# Altium schematic sheet GPS_L70.SchDoc
size A; SheetNumber: 7; SheetTotal: 7
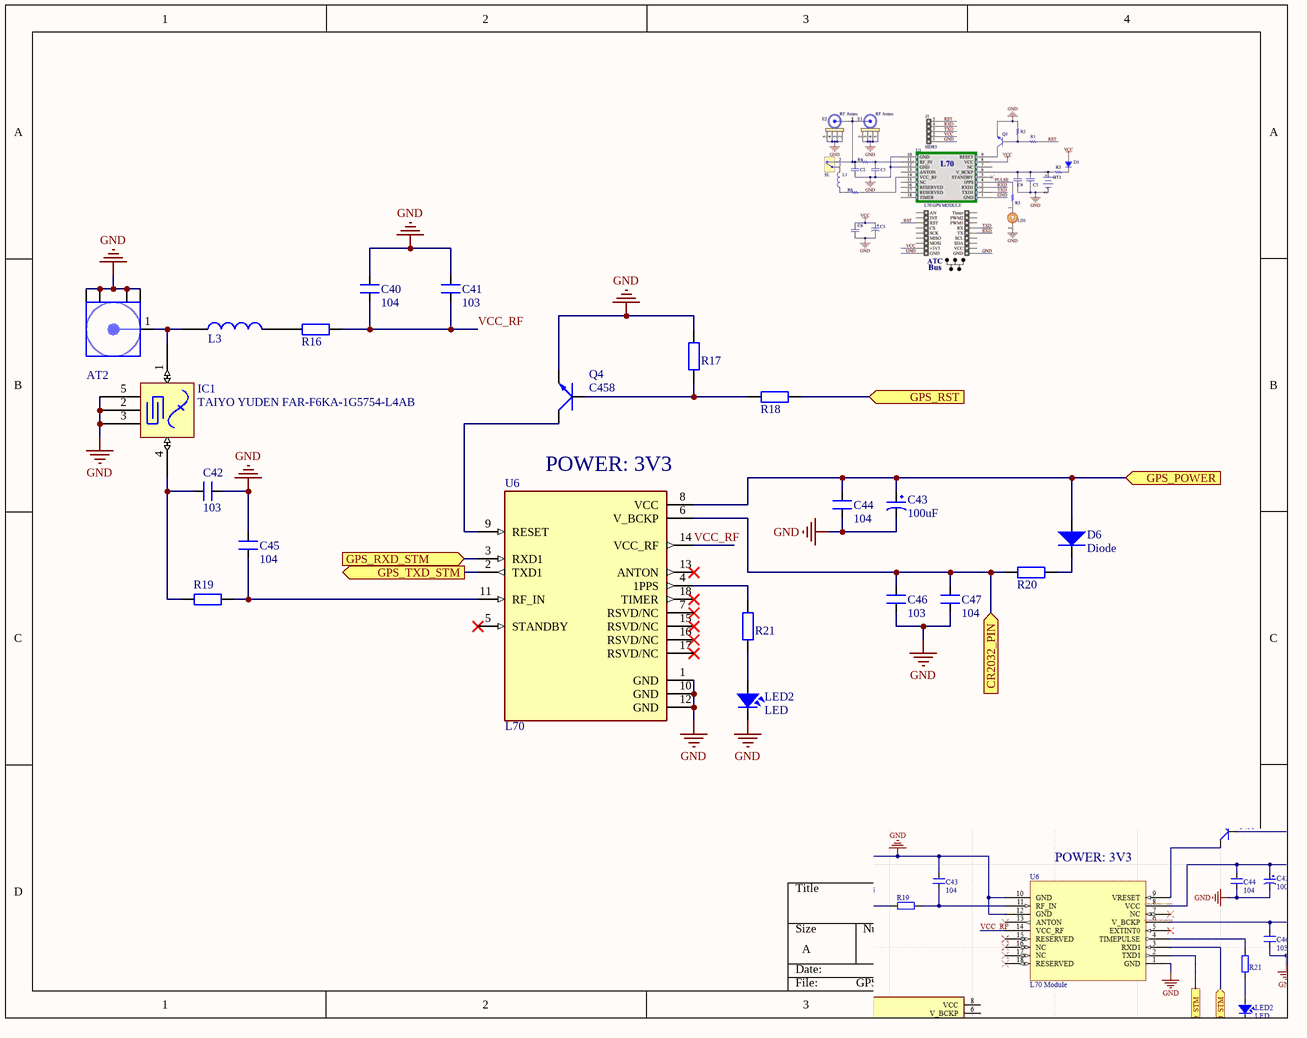
[diagram p0: GPS_L70.SchDoc]

## Parts
AT2  AT-GSM-GPS  [SNW_H13-L17-SMA]  (value not drawn)
C40  104  [CN2]
C41  103  [SM-0805]
C42  103  [SM-0805]
C43  100uF  [CP1/2.5]
C44  104  [CN2]
C45  104  [CN2]
C46  103  [SM-0805]
C47  104  [CN2]
D6  Diode  [DIO-SMD-106]
IC1  TAIYO YUDEN FAR-F6KA-1G5754-L4AB  [TAIYO YUDEN SMD-5 1.4x1mm]
L3  15uH/850mA  [IND-1210 (3225)]  (value not drawn)
LED2  LED  [SM-LED-0805-Blue]
Q4  C458  [SOT23-321]
R16  1k  [RES-SMD-0101]  (value not drawn)
R17  1k  [RES-SMD-0101]  (value not drawn)
R18  1k  [RES-SMD-0101]  (value not drawn)
R19  1k  [RES-SMD-0101]  (value not drawn)
R20  1k  [RES-SMD-0101]  (value not drawn)
R21  1k  [RES-SMD-0101]  (value not drawn)
U6  L70  [XCVR_L70]

## Ports
CR2032_PIN (in), GPS_POWER (in), GPS_RST (in), GPS_RXD_STM (in), GPS_TXD_STM (out)

## Nets
GND: AT2.2 C40.1 C41.2 C42.1 C43.2 C44.1 C45.2 C46.2 C47.1 IC1.2(GND) IC1.3(GND) IC1.5(GND) LED2.2 Q4.1(E) R17.2 U6.1(GND) U6.10(GND) U6.12(GND)
CR2032_PIN: C46.1 C47.2 R20.2 U6.6(V_BCKP) ; port CR2032_PIN
GPS_POWER: C43.1 C44.2 D6.1 U6.8(VCC) ; port GPS_POWER
GPS_RST: R18.1 ; port GPS_RST
GPS_RXD_STM: U6.3(RXD1) ; port GPS_RXD_STM
GPS_TXD_STM: U6.2(TXD1) ; port GPS_TXD_STM
VCC_RF: C40.2 C41.1 R16.2 U6.14(VCC_RF)
NetAT2_1: AT2.1(Signal) IC1.1(IN) L3.1
NetC42_2: C42.2 IC1.4(OUT) R19.1
NetC45_1: C45.1 R19.2 U6.11(RF_IN)
NetD6_2: D6.2 R20.1
NetL3_2: L3.2 R16.1
NetLED2_1: LED2.1 R21.2
NetQ4_2: Q4.2(C) U6.9(RESET)
NetQ4_3: Q4.3(B) R17.1 R18.2
NetR21_1: R21.1 U6.4(1PPS)

Not connected (* = marked no-connect by the designer): U6 5(STANDBY)* 7(RSVD/NC)* 13(ANTON)* 15(RSVD/NC)* 16(RSVD/NC)* 17(RSVD/NC)* 18(TIMER)*

## Notes on the sheet
- POWER: 3V3

## Library data of the parts
AT2 = SNW_H13-L17-SMA: CONNECTER ANTENNA GPS GSM; MFR: Sunny Way; Solder: HAND; MPN: SNW_H13-L17-SMA; Value: AT-GSM-GPS
C40 C44 C45 C47 = CN2: Cap np 104 => 105pF; Value: 0.1uF
C41 C42 C46 = CM: Cap SMD; Value: 103
C43 = CP2: C 47uF/50V , 220uF/16V; Value: 47uF/16 - 50V; Description 1: 470uF/6,3V - 330uF/10V - 220uF/16V; Description 2: 100uF/25V - 35V - 47uF/50V - 22uF/100V; Description 3: 33uF => 47uF/63V - 1uF => 4,7uF/160V; Description 4: 1uF => 2,2uF/250V - 1uF/350V
IC1 = TAIYO YUDEN FAR-F6KA-1G5754-L4AB: GPS SAW Filter Taiyo Yuden
L3 = CBC3225T150KR: FIXED IND 15UH 850MA 253.5 MOHM; MFR: Taiyo Yuden; Solder: SMT; MPN: CBC3225T150KR; Value: 15uH/850mA; Category: INDUCTOR
Q4 = C458: NPN 600mW, ECB; Value: C1815
R16-R21 = R: Resistor R1/4W
U6 = L70: GPS Module <a href="https://pricing.snapeda.com/parts/L70/Quectel/view-part?ref=eda">Check prices</a> <a href="https://pricing.snapeda.com/parts/L70/Quectel/view-part?ref=eda">Check prices</a>; Availability: Unavailable; Value: *; Package: None; Price: None; MP: L70